# Altium schematic sheet ShiftRegisterSensor.SchDoc
size A
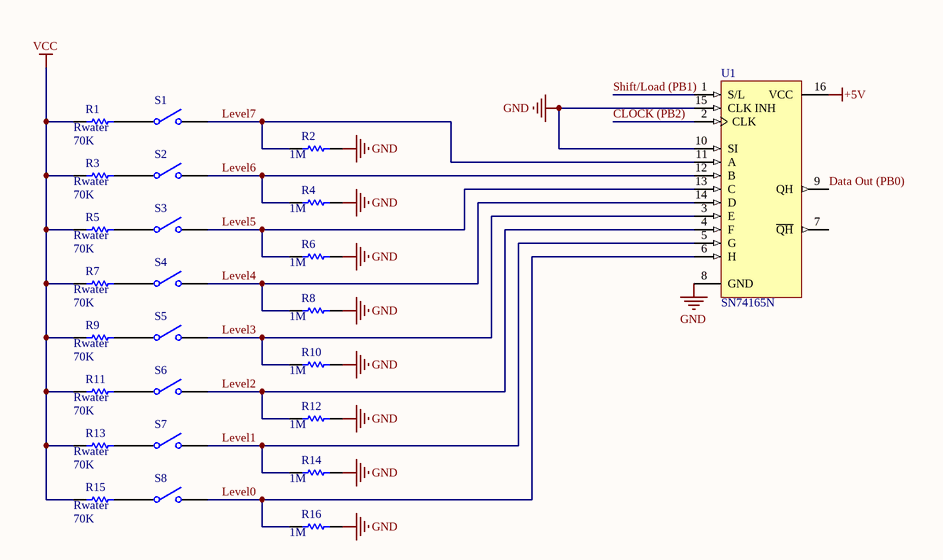
[diagram p0: ShiftRegisterSensor.SchDoc]

## Parts
R1  Rwater  value 70K  [AXIAL-0.3]
R2  value 1M  [AXIAL-0.3]  (hidden comment: Res1)
R3  Rwater  value 70K  [AXIAL-0.3]
R4  value 1M  [AXIAL-0.3]  (hidden comment: Res1)
R5  Rwater  value 70K  [AXIAL-0.3]
R6  value 1M  [AXIAL-0.3]  (hidden comment: Res1)
R7  Rwater  value 70K  [AXIAL-0.3]
R8  value 1M  [AXIAL-0.3]  (hidden comment: Res1)
R9  Rwater  value 70K  [AXIAL-0.3]
R10  value 1M  [AXIAL-0.3]  (hidden comment: Res1)
R11  Rwater  value 70K  [AXIAL-0.3]
R12  value 1M  [AXIAL-0.3]  (hidden comment: Res1)
R13  Rwater  value 70K  [AXIAL-0.3]
R14  value 1M  [AXIAL-0.3]  (hidden comment: Res1)
R15  Rwater  value 70K  [AXIAL-0.3]
R16  value 1M  [AXIAL-0.3]  (hidden comment: Res1)
S1  SW-SPST  [SPST-2]  (value not drawn)
S2  SW-SPST  [SPST-2]  (value not drawn)
S3  SW-SPST  [SPST-2]  (value not drawn)
S4  SW-SPST  [SPST-2]  (value not drawn)
S5  SW-SPST  [SPST-2]  (value not drawn)
S6  SW-SPST  [SPST-2]  (value not drawn)
S7  SW-SPST  [SPST-2]  (value not drawn)
S8  SW-SPST  [SPST-2]  (value not drawn)
U1  SN74165N  [DIP-16/X1.5]

## Nets
+5V: U1.16(VCC)
GND: R2.2 R4.2 R6.2 R8.2 R10.2 R12.2 R14.2 R16.2 U1.8(GND) U1.10(SI) U1.15(CLK_INH)
VCC: R1.1 R3.1 R5.1 R7.1 R9.1 R11.1 R13.1 R15.1
CLOCK (PB2): U1.2(CLK)
Data Out (PB0): U1.9(QH)
Level0: R16.1 S8.2(NO) U1.6(H)
Level1: R14.1 S7.2(NO) U1.5(G)
Level2: R12.1 S6.2(NO) U1.4(F)
Level3: R10.1 S5.2(NO) U1.3(E)
Level4: R8.1 S4.2(NO) U1.14(D)
Level5: R6.1 S3.2(NO) U1.13(C)
Level6: R4.1 S2.2(NO) U1.12(B)
Level7: R2.1 S1.2(NO) U1.11(A)
Shift/Load (PB1): U1.1(S/L)
NetR1_2: R1.2 S1.1(COMMON)
NetR3_2: R3.2 S2.1(COMMON)
NetR5_2: R5.2 S3.1(COMMON)
NetR7_2: R7.2 S4.1(COMMON)
NetR9_2: R9.2 S5.1(COMMON)
NetR11_2: R11.2 S6.1(COMMON)
NetR13_2: R13.2 S7.1(COMMON)
NetR15_2: R15.2 S8.1(COMMON)

Not connected (* = marked no-connect by the designer): U1 7(~{QH})

## Library data of the parts
R1-R16 = Res1: Resistor; Published: 8-Jun-2000; LatestRevisionDate: 17-Jul-2002; LatestRevisionNote: Re-released for DXP Platform.; PackageReference: AXIAL-0.3; Publisher: Altium Limited; PackageDescription: Axial Device, Thru-Hole; 2 Leads; 0.3 in Pin Spacing
S1-S8 = SW-SPST: Single-Pole, Single-Throw Switch; Published: 24-Mar-1999; LatestRevisionDate: 17-Jul-2002; LatestRevisionNote: Re-released for DXP Platform.; PackageReference: SPST-2; Publisher: Altium Limited; PackageDescription: Switch; 2 Leads
U1 = SN74165N: Parallel-Load 8-Bit Shift Register; Manufacturer: Texas Instruments; Class: Logic; Published: 8/06/2000; Publisher: Altium Hobart Technology Centre; SubClass: Register